# Altium schematic sheet Connectors.SchDoc
size A3
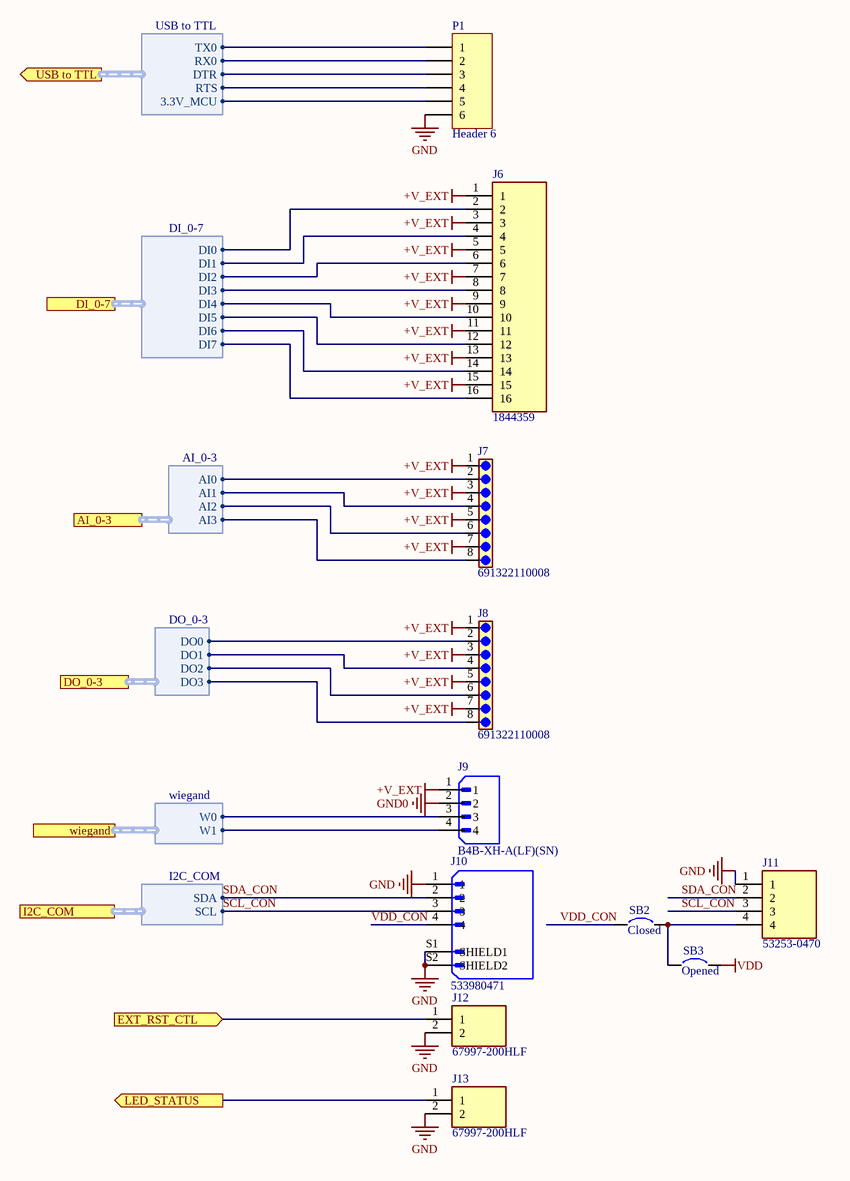
[diagram p0: Connectors.SchDoc]

## Parts
J6  1844359  [1844359]
J7  691322110008  [691322110008]
J8  691322110008  [691322110008]
J9  B4B-XH-A(LF)(SN)  [JST_B4B-XH-A(LF)(SN)]
J10  533980471  [MOLEX_533980471]
J11  53253-0470  [SHDR4W50P0X200_1X4_1000X365X550P]
J12  67997-200HLF  [HDRV2W67P254_2X1_254X483X858P]
J13  67997-200HLF  [HDRV2W67P254_2X1_254X483X858P]
P1  Header 6  [HDR1X6]
SB2  Closed  [SB_0603]
SB3  Opened  [SB_0603]

## Ports
AI_0-3 (harness AI_0-3), DI_0-7 (harness DI_0-7), DO_0-3 (harness DO_0-3), EXT_RST_CTL (in), I2C_COM (harness I2C_COM), LED_STATUS (out), USB to TTL (out, harness USB to TTL), wiegand (harness wiegand)

## Harnesses
USB to TTL: TX0, RX0, DTR, RTS, 3.3V_MCU
DI_0-7: DI0, DI1, DI2, DI3, DI4, DI5, DI6, DI7
AI_0-3: AI0, AI1, AI2, AI3
DO_0-3: DO0, DO1, DO2, DO3
wiegand: W0, W1
I2C_COM: SDA, SCL

## Nets
+V_EXT: J6.1 J6.3 J6.5 J6.7 J6.9 J6.11 J6.13 J6.15 J7.1 J7.3 J7.5 J7.7 J8.1 J8.3 J8.5 J8.7 J9.1
GND: J10.1 J10.S1(SHIELD1) J10.S2(SHIELD2) J11.1 J12.2 J13.2 P1.6
GND0: J9.2
VDD: SB3.2
EXT_RST_CTL: J12.1 ; port EXT_RST_CTL
LED_STATUS: J13.1 ; port LED_STATUS
SCL_CON: J10.3 J11.3 ; port I2C_COM.SCL
SDA_CON: J10.2 J11.2 ; port I2C_COM.SDA
VDD_CON: J10.4 SB2.1
NetJ6_2: J6.2 ; port DI_0-7.DI0
NetJ6_4: J6.4 ; port DI_0-7.DI1
NetJ6_6: J6.6 ; port DI_0-7.DI2
NetJ6_8: J6.8 ; port DI_0-7.DI3
NetJ6_10: J6.10 ; port DI_0-7.DI4
NetJ6_12: J6.12 ; port DI_0-7.DI5
NetJ6_14: J6.14 ; port DI_0-7.DI6
NetJ6_16: J6.16 ; port DI_0-7.DI7
NetJ7_2: J7.2 ; port AI_0-3.AI0
NetJ7_4: J7.4 ; port AI_0-3.AI1
NetJ7_6: J7.6 ; port AI_0-3.AI2
NetJ7_8: J7.8 ; port AI_0-3.AI3
NetJ8_2: J8.2 ; port DO_0-3.DO0
NetJ8_4: J8.4 ; port DO_0-3.DO1
NetJ8_6: J8.6 ; port DO_0-3.DO2
NetJ8_8: J8.8 ; port DO_0-3.DO3
NetJ9_3: J9.3 ; port wiegand.W0
NetJ9_4: J9.4 ; port wiegand.W1
NetJ11_4: J11.4 SB2.2 SB3.1
NetP1_1: P1.1 ; port USB to TTL.TX0
NetP1_2: P1.2 ; port USB to TTL.RX0
NetP1_3: P1.3 ; port USB to TTL.DTR
NetP1_4: P1.4 ; port USB to TTL.RTS
NetP1_5: P1.5 ; port USB to TTL.3.3V_MCU

## Library data of the parts
J6 = 1844359: Connector; Manufacturer_Name: Phoenix Contact; Datasheet Link: http://www.phoenixcontact.com/gb/produkte/1844359; Height: 8.25mm; Manufacturer_Part_Number: 1844359; Mouser Part Number: 651-1844359; Mouser Price/Stock: https://www.mouser.co.uk/ProductDetail/Phoenix-Contact/1844359?qs=p6trItWzfMVaCsKEKQREhQ%3D%3D; Arrow Part Number: 1844359; Arrow Price/Stock: https://www.arrow.com/en/products/1844359/phoenix-contact?region=nac
J7 J8 = 691322110008: 8 Position Terminal Block Header, Male Pins, Shrouded (4 Side) 0.138 (3.50mm) 90Â°, Right Angle Through Hole; MF: Wurth Electronics; SnapEDA_Link: https://www.snapeda.com/parts/691322110008/Wurth+Electronics+Inc./view-part/?ref=snap; Package: None; Value: *; MP: 691322110008; Check_prices: https://www.snapeda.com/parts/691322110008/Wurth+Electronics+Inc./view-part/?ref=eda
J9 = B4B-XH-A(LF)(SN): Connector Header Through Hole 4 position 0.098 (2.50mm); MF: JST Sales; SnapEDA_Link: https://www.snapeda.com/parts/B4B-XH-A(LF)(SN)/JST+Sales+America+Inc./view-part/?ref=snap; Package: None; Value: *; MP: B4B-XH-A(LF)(SN); Check_prices: https://www.snapeda.com/parts/B4B-XH-A(LF)(SN)/JST+Sales+America+Inc./view-part/?ref=eda
J10 = 533980471: Conn Shrouded Header (3 Sides) HDR 4 POS 1.25mm Solder ST Top Entry SMD PicoBladeâ„¢ T/R; MF: Molex; Package: None; Purchase-URL: https://pricing.snapeda.com/search/part/533980471/?ref=eda; Digi-Key_Part_Number: WM7608TR-ND; Check_prices: https://www.snapeda.com/parts/533980471/Molex/view-part/?ref=eda; MP: 533980471; SnapEDA_Link: https://www.snapeda.com/parts/533980471/Molex/view-part/?ref=snap; Value: *
J11 = 53253-0470: Connector; Manufacturer_Name: Molex; Datasheet Link: https://www.molex.com/pdm_docs/sd/532530870_sd.pdf; Height: 5.5mm; Manufacturer_Part_Number: 53253-0470; Mouser Part Number: 538-53253-0470; Mouser Price/Stock: https://www.mouser.co.uk/ProductDetail/Molex/53253-0470?qs=8PELaTI4Pt%2FLA1isvUDoOA%3D%3D
J12 J13 = 67997-200HLF: Connector; Manufacturer_Name: Amphenol Communications Solutions; Datasheet Link: https://cdn.amphenol-cs.com/media/wysiwyg/files/drawing/67996.pdf; Height: 8.58mm; Manufacturer_Part_Number: 67997-200HLF; Mouser Part Number: 649-67997-200HLF; Mouser Price/Stock: https://www.mouser.co.uk/ProductDetail/Amphenol-FCI/67997-200HLF?qs=cpLrBgdhsoGV8OGn4cOuWg%3D%3D; Arrow Part Number: 67997-200HLF; Arrow Price/Stock: https://www.arrow.com/en/products/67997-200hlf/amphenol-fci
P1 = Header 6: Header, 6-Pin; LatestRevisionDate: 17-Jul-2002; LatestRevisionNote: Re-released for DXP Platform.; Publisher: Altium Limited
SB2 SB3 = Circuit Breaker_close: Circuit Breaker; Published: 24-Mar-1999; Revision: July-2002: Re-released for DXP Platform.; Publisher: Altium Limited